# Altium schematic sheet current_controller.SchDoc
size A3
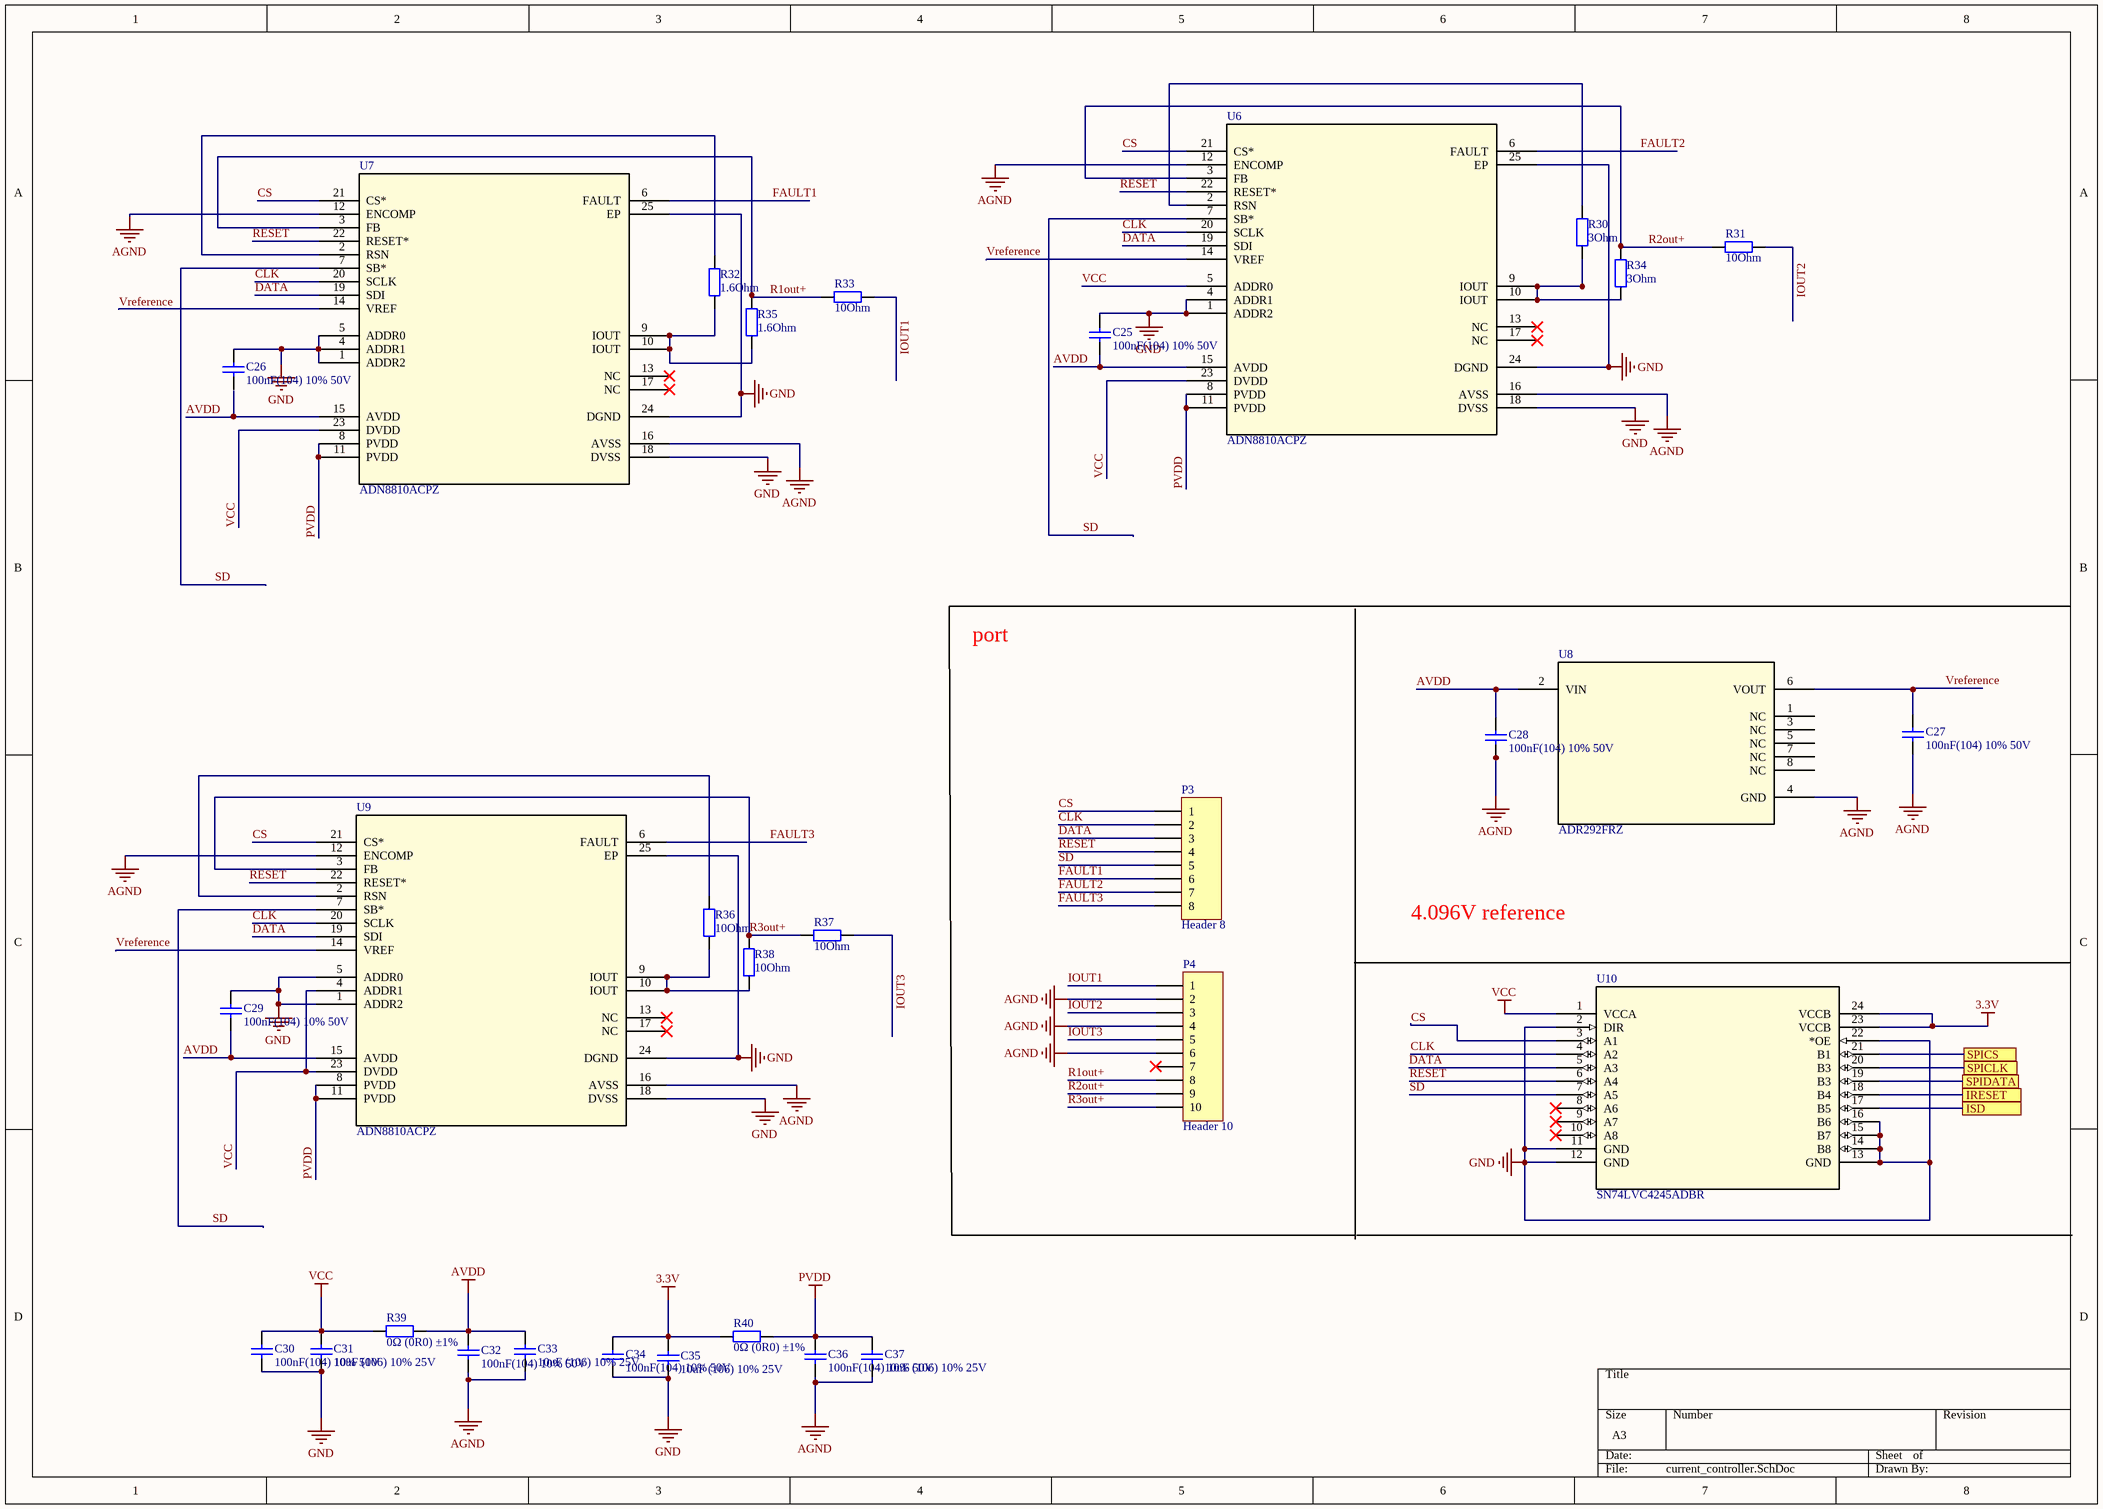
[diagram p0: current_controller.SchDoc]

## Parts
C25  100nF(104) 10% 50V  [0805_C]
C26  100nF(104) 10% 50V  [0805_C]
C27  100nF(104) 10% 50V  [0805_C]
C28  100nF(104) 10% 50V  [0805_C]
C29  100nF(104) 10% 50V  [0805_C]
C30  100nF(104) 10% 50V  [0805_C]
C31  10uF (106) 10% 25V  [0805_C]
C32  100nF(104) 10% 50V  [0805_C]
C33  10uF (106) 10% 25V  [0805_C]
C34  100nF(104) 10% 50V  [0805_C]
C35  10uF (106) 10% 25V  [0805_C]
C36  100nF(104) 10% 50V  [0805_C]
C37  10uF (106) 10% 25V  [0805_C]
P3  Header 8  [HDR1X8]
P4  Header 10  [HDR1X10]
R30  3Ohm  [AXIAL-0.4]
R31  10Ohm  [AXIAL-0.4]
R32  1.6Ohm  [AXIAL-0.4]
R33  10Ohm  [AXIAL-0.4]
R34  3Ohm  [AXIAL-0.4]
R35  1.6Ohm  [AXIAL-0.4]
R36  10Ohm  [AXIAL-0.4]
R37  10Ohm  [AXIAL-0.4]
R38  10Ohm  [AXIAL-0.4]
R39  0Ω (0R0) ±1%  [0603_R]
R40  0Ω (0R0) ±1%  [0603_R]
U6  ADN8810ACPZ  [CP_24_1]
U7  ADN8810ACPZ  [CP_24_1]
U8  ADR292FRZ  [R_8]
U9  ADN8810ACPZ  [CP_24_1]
U10  SN74LVC4245ADBR  [DB24]

## Ports
IRESET, ISD, SPICLK, SPICS, SPIDATA

## Nets
3.3V: C34.2 R40.1 U10.23(VCCB) U10.24(VCCB)
AGND: C27.1 C28.1 C32.2 C33.2 C36.2 C37.2 P4.2 P4.4 P4.6 U6.12(ENCOMP) U6.16(AVSS) U7.12(ENCOMP) U7.16(AVSS) U8.4(GND) U9.12(ENCOMP) U9.16(AVSS)
AVDD: C25.1 C28.2 C29.1 C33.1 R39.2 U6.15(AVDD) U7.15(AVDD) U8.2(VIN) U9.15(AVDD)
GND: C25.2 C26.2 C29.2 C30.2 C31.1 C34.1 C35.1 U6.1(ADDR2) U6.4(ADDR1) U6.18(DVSS) U6.24(DGND) U6.25(EP) U7.1(ADDR2) U7.4(ADDR1) U7.5(ADDR0) U7.18(DVSS) U7.24(DGND) U7.25(EP) U9.1(ADDR2) U9.5(ADDR0) U9.18(DVSS) U9.24(DGND) U9.25(EP) U10.2(DIR) U10.11(GND) U10.12(GND) U10.13(GND) U10.14(B8) U10.15(B7) U10.16(B6) U10.22(*OE)
PVDD: C36.1 C37.1 R40.2 U6.8(PVDD) U6.11(PVDD) U7.8(PVDD) U7.11(PVDD) U9.8(PVDD) U9.11(PVDD)
VCC: C30.1 C31.2 R39.1 U6.5(ADDR0) U6.23(DVDD) U7.23(DVDD) U9.4(ADDR1) U9.23(DVDD) U10.1(VCCA)
CLK: P3.2 U6.20(SCLK) U7.20(SCLK) U9.20(SCLK) U10.4(A2)
CS: P3.1 U6.21(CS*) U7.21(CS*) U9.21(CS*) U10.3(A1)
DATA: P3.3 U6.19(SDI) U7.19(SDI) U9.19(SDI) U10.5(A3)
FAULT1: P3.6 U7.6(FAULT)
FAULT2: P3.7 U6.6(FAULT)
FAULT3: P3.8 U9.6(FAULT)
IOUT1: P4.1 R33.1
IOUT2: P4.3 R31.1
IOUT3: P4.5 R37.1
IRESET: U10.18(B4) ; port IRESET
ISD: U10.17(B5) ; port ISD
R1out+: P4.8 R33.2 R35.2 U7.3(FB)
R2out+: P4.9 R31.2 R34.2 U6.3(FB)
R3out+: P4.10 R37.2 R38.2 U9.3(FB)
RESET: P3.4 U6.22(RESET*) U7.22(RESET*) U9.22(RESET*) U10.6(A4)
SD: P3.5 U6.7(SB*) U7.7(SB*) U9.7(SB*) U10.7(A5)
SPICLK: U10.20(B3) ; port SPICLK
SPICS: U10.21(B1) ; port SPICS
SPIDATA: U10.19(B3) ; port SPIDATA
Vreference: C27.2 U6.14(VREF) U7.14(VREF) U8.6(VOUT) U9.14(VREF)
NetR30_1: R30.1 R34.1 U6.9(IOUT) U6.10(IOUT)
NetR30_2: R30.2 U6.2(RSN)
NetR32_1: R32.1 R35.1 U7.9(IOUT) U7.10(IOUT)
NetR32_2: R32.2 U7.2(RSN)
NetR36_1: R36.1 R38.1 U9.9(IOUT) U9.10(IOUT)
NetR36_2: R36.2 U9.2(RSN)

Not connected (* = marked no-connect by the designer): C26 1; C32 1; C35 2; P4 7*; U6 13(NC)* 17(NC)*; U7 13(NC)* 17(NC)*; U8 1(NC) 3(NC) 5(NC) 7(NC) 8(NC); U9 13(NC)* 17(NC)*; U10 8(A6)* 9(A7)* 10(A8)*

## Notes on the sheet
- port
- 4.096V reference

## Library data of the parts
C25-C30 C32 C34 C36 = 0805 100nF(104) 10% 50V: 贴片电容; ComponentLink1Description: 供应商链接; ComponentLink1URL: http://www.szlcsc.com/product/details_50686.html; Package: 0805; Supplier: LC; SuppliersPartNumber: C49678
C31 C33 C35 C37 = 0805 10uF (106) 10% 25V: 贴片电容; ComponentLink1Description: 供应商链接; ComponentLink1URL: http://www.szlcsc.com/product/details_16532.html; Package: 0805; Supplier: LC; SuppliersPartNumber: C15850
P3 = Header 8: Header, 8-Pin; LatestRevisionDate: 17-Jul-2002; LatestRevisionNote: Re-released for DXP Platform.; Publisher: Altium Limited
P4 = Header 10: Header, 10-Pin; LatestRevisionDate: 17-Jul-2002; LatestRevisionNote: Re-released for DXP Platform.; Publisher: Altium Limited
R30 R34 = Res2: 1% resistance; Value: 3; Published: 8-Jun-2000; LatestRevisionDate: 17-Jul-2002; LatestRevisionNote: Re-released for DXP Platform.; PackageReference: AXIAL-0.4; Publisher: Altium Limited; PackageDescription: Axial Device, Thru-Hole; 2 Leads; 0.4 in Pin Spacing
R31 R33 R36-R38 = Res2: 1% resistance; Value: 10; Published: 8-Jun-2000; LatestRevisionDate: 17-Jul-2002; LatestRevisionNote: Re-released for DXP Platform.; PackageReference: AXIAL-0.4; Publisher: Altium Limited; PackageDescription: Axial Device, Thru-Hole; 2 Leads; 0.4 in Pin Spacing
R32 R35 = Res2: 1% resistance; Value: 1.6; Published: 8-Jun-2000; LatestRevisionDate: 17-Jul-2002; LatestRevisionNote: Re-released for DXP Platform.; PackageReference: AXIAL-0.4; Publisher: Altium Limited; PackageDescription: Axial Device, Thru-Hole; 2 Leads; 0.4 in Pin Spacing
R39 R40 = 0603 0Ω (0R0) 1%: 贴片电阻; ComponentLink1Description: 供应商链接; ComponentLink1URL: http://www.szlcsc.com/product/details_21903.html; Package: 0603; Supplier: LC; SuppliersPartNumber: C21189
U6 U7 U9 = ADN8810ACPZ: Imported; Manufacturer_Part_Number: ADN8810ACPZ; Vendor: Vendor; RefDes: Refdes; Type: Type; Value: Value
U8 = ADR292FRZ: Imported; Manufacturer_Part_Number: ADR292FRZ; Vendor: Vendor; RefDes: Refdes; Type: Type; Value: Value
U10 = SN74LVC4245ADBR: Octal Bus Transceiver And 3.3-V To 5-V Shifter With 3-State Outputs; Manufacturer: Texas Instruments; INDUSTRY_STD_PKG_TYPE: SSOP; FAMILY_NAME: DIRECTION CONTROL DUAL SUPPLY TRANSLATOR; PIN_COUNT: 24; PACKAGE_DESIGNATOR: DB; Datasheet_URL: http://www.ti.com/lit/gpn/SN74LVC4245A; GENERIC_PART_NUMBER: SN74LVC4245A; Vendor: Texas Instruments; Manufacturer_Part_Number: SN74LVC4245ADBR; Copyright: Copyright (C) 2018 Accelerated Designs. All rights reserved; RefDes: RefDes; Type: DEV